# Altium schematic sheet Sheet_1_2023-03-25.schdoc
size 857 x 411 mm
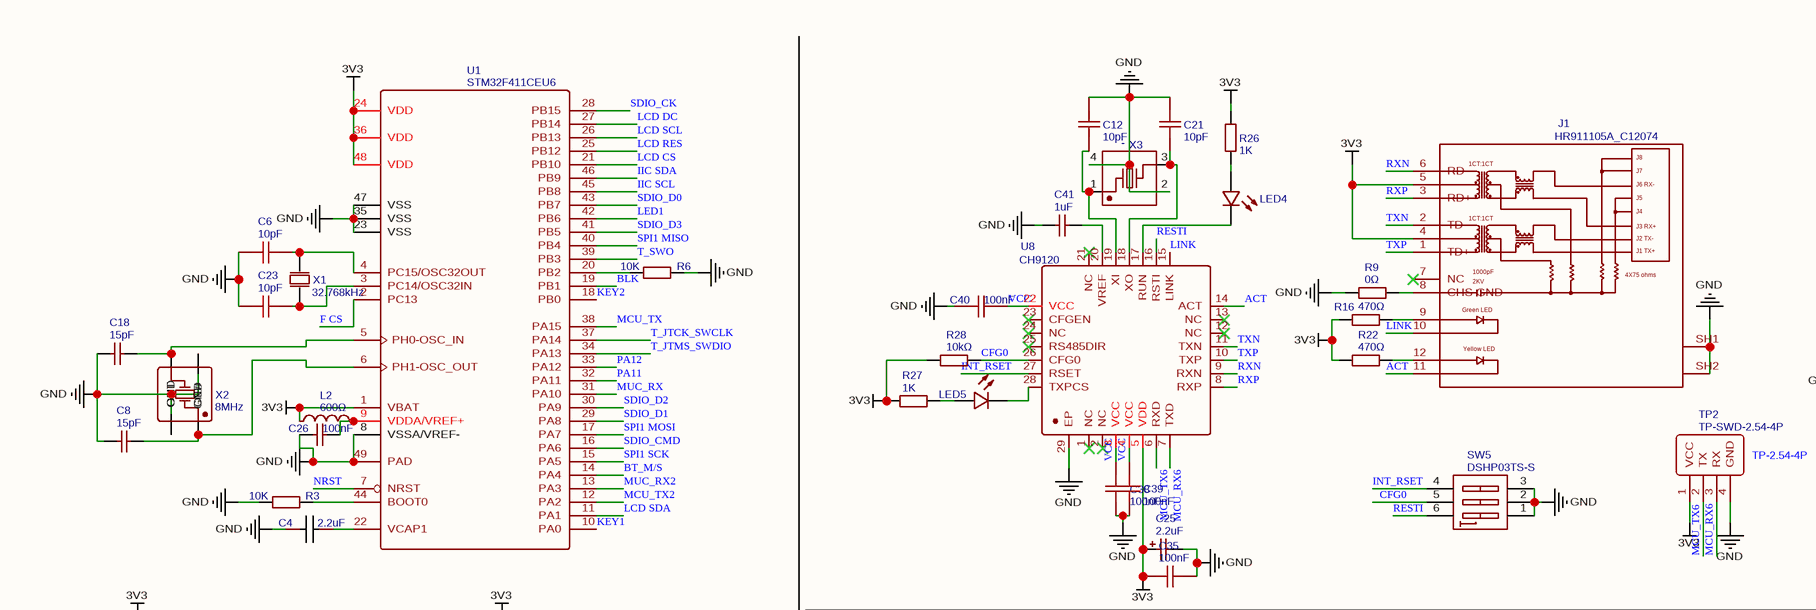
[diagram p0: Sheet_1_2023-03-25.schdoc, top left]
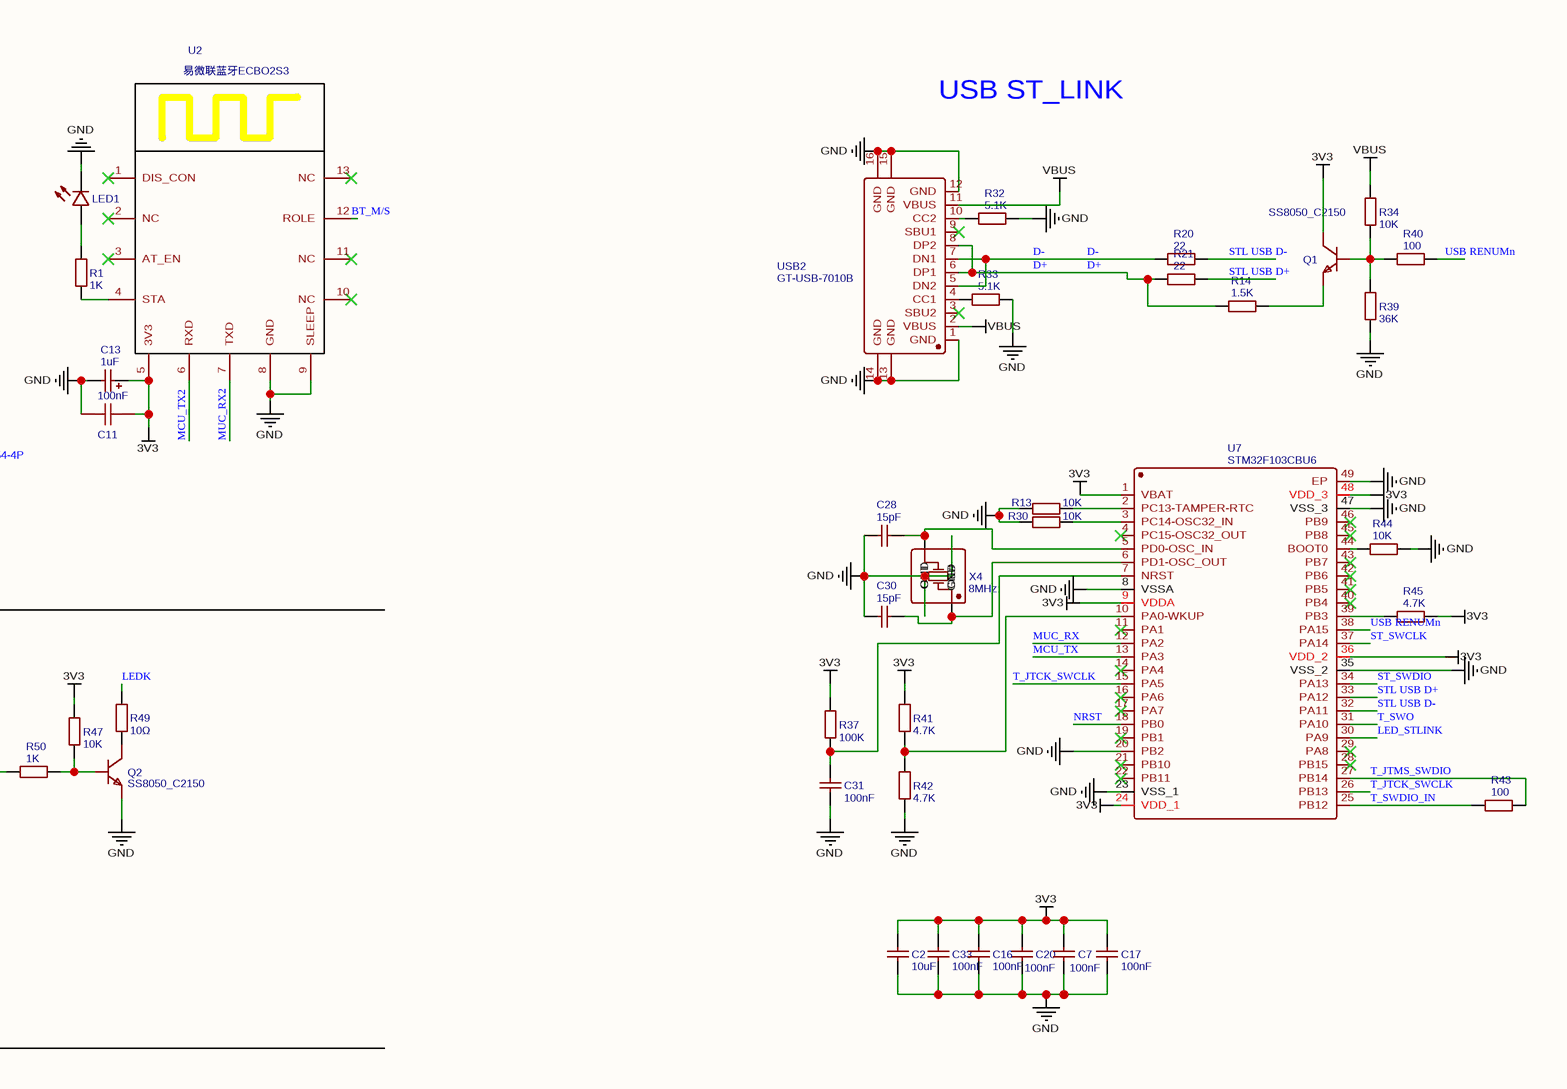
[diagram p1: Sheet_1_2023-03-25.schdoc, top middle]
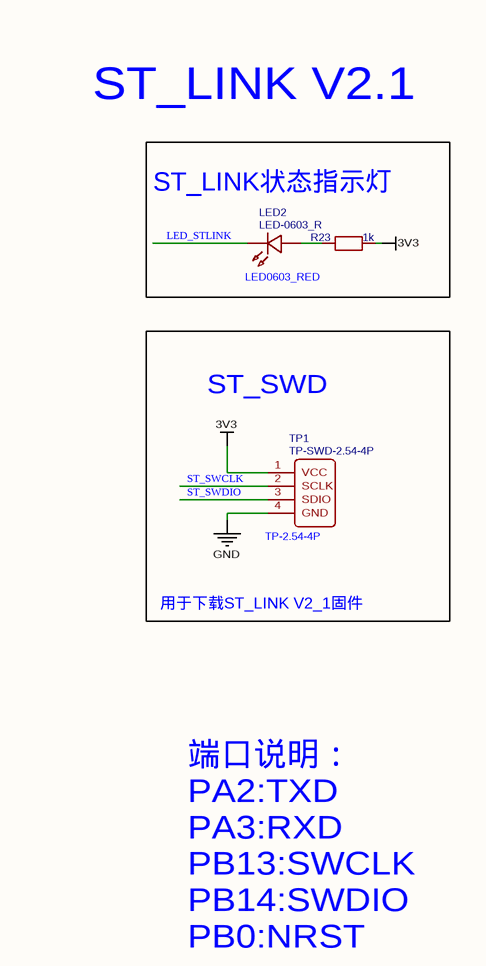
[diagram p2: Sheet_1_2023-03-25.schdoc, top right]
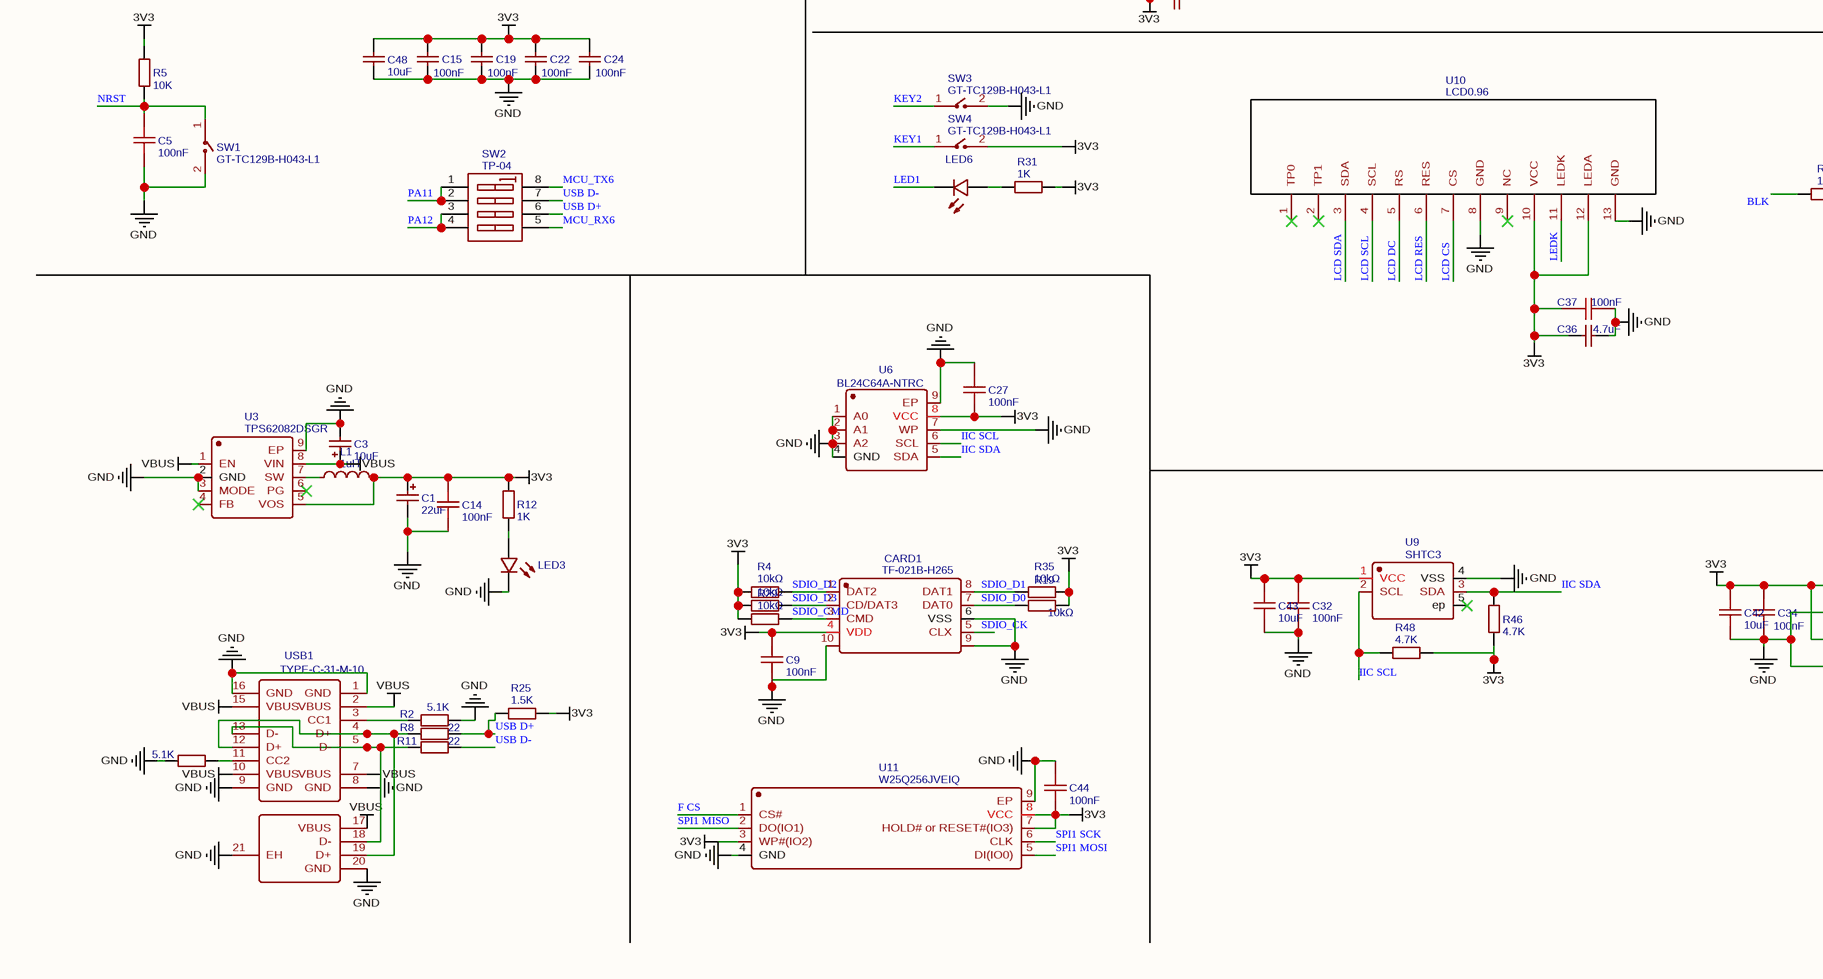
[diagram p3: Sheet_1_2023-03-25.schdoc, bottom left]
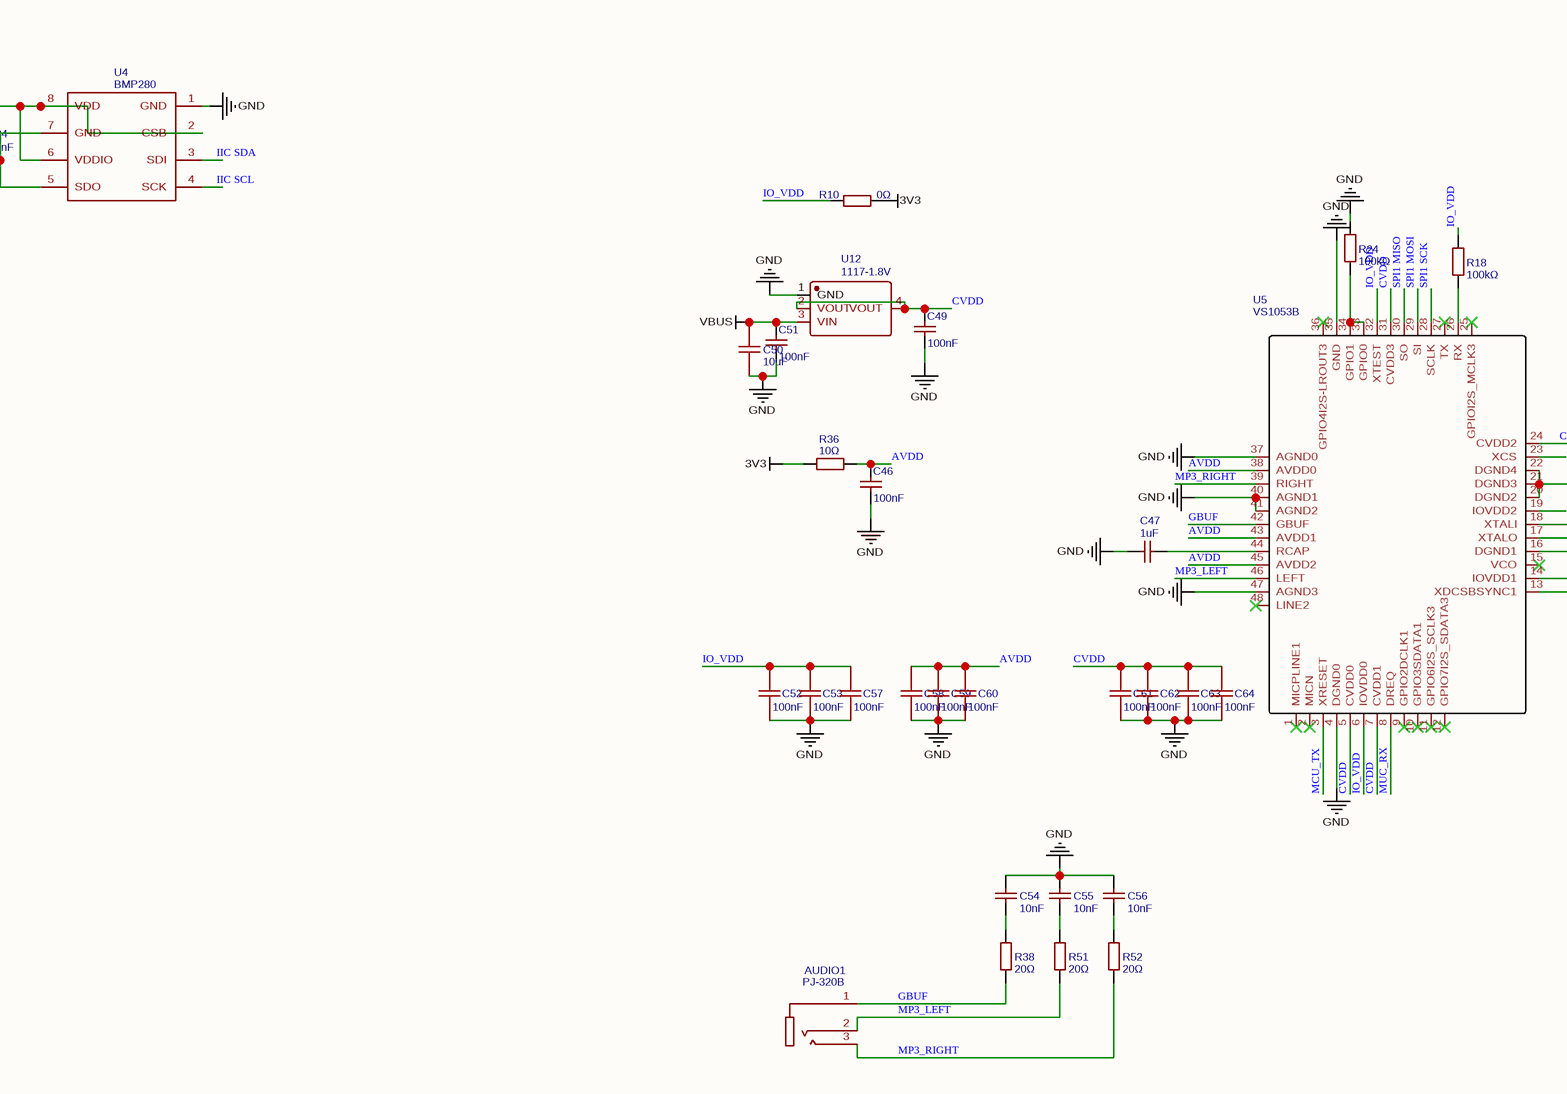
[diagram p4: Sheet_1_2023-03-25.schdoc, bottom middle]
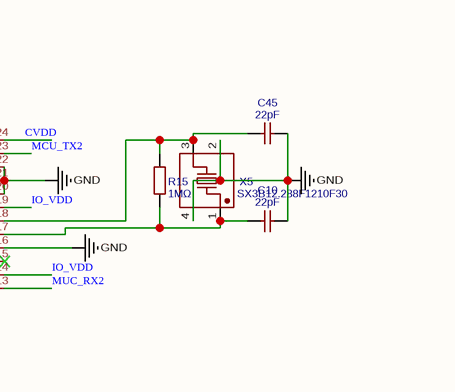
[diagram p5: Sheet_1_2023-03-25.schdoc, bottom right]

## Parts
AUDIO1  PJ-320B  [AUDIO-SMD_PJ-320B]
C1  22uF  [CAP-SMD_L3.2-W1.6-R-RD]
C2  10uF  [C0402]
C3  10uF  [CAP-SMD_L3.2-W1.6-R-RD]
C4  2.2uF  [C0402]
C5  100nF  [C0603]
C6  10pF  [C0402]
C7  100nF  [C0402_NEW]
C8  15pF  [C0402]
C9  100nF  [C0603]
C10  22pF  [C0603]
C11  100nF  [C0603]
C12  10pF  [C0402]
C13  1uF  [CAP-SMD_L3.2-W1.6-R-RD]
C14  100nF  [C0603]
C15  100nF  [C0402_NEW]
C16  100nF  [C0402_NEW]
C17  100nF  [C0402_NEW]
C18  15pF  [C0402]
C19  100nF  [C0402_NEW]
C20  100nF  [C0402_NEW]
C21  10pF  [C0402]
C22  100nF  [C0402_NEW]
C23  10pF  [C0402]
C24  100nF  [C0402_NEW]
C25  2.2uF  [CAP-SMD_L3.2-W1.6-RD]
C26  100nF  [C0402_NEW]
C27  100nF  [C0603]
C28  15pF  [C0402]
C30  15pF  [C0402]
C31  100nF  [C0402_NEW]
C32  100nF  [C0603]
C33  100nF  [C0402_NEW]
C34  100nF  [C0603]
C35  100nF  [C0603]
C36  4.7uF  [C0603]
C37  100nF  [C0603]
C38  100nF  [C0603]
C39  100nF  [C0603]
C40  100nF  [C0603]
C41  1uF  [C0603]
C42  10uF  [C0603]
C43  10uF  [C0603]
C44  100nF  [C0603]
C45  22pF  [C0603]
C46  100nF  [C0603]
C47  1uF  [C0603]
C48  10uF  [C0402]
C49  100nF  [C0603]
C50  10uF  [C0603]
C51  100nF  [C0603]
C52  100nF  [C0603]
C53  100nF  [C0603]
C54  10nF  [C0603]
C55  10nF  [C0603]
C56  10nF  [C0603]
C57  100nF  [C0603]
C58  100nF  [C0603]
C59  100nF  [C0603]
C60  100nF  [C0603]
C61  100nF  [C0603]
C62  100nF  [C0603]
C63  100nF  [C0603]
C64  100nF  [C0603]
CARD1  TF-021B-H265  [TF-SMD_TF-021B-H265]
J1  HR911105A_C12074  [RJ45-TH_HR911105A]
L1  1uH  [IND-SMD_L3.0-W3.0]
L2  600Ω  [L0402]
LED1  19-213/Y2C-CQ2R2L/3T(CY)  [LED0603-R-RD]  (value not drawn)
LED2  LED-0603_R  [LED0603_RED]
LED3  19-213/Y2C-CQ2R2L/3T(CY)  [LED0603-R-RD]  (value not drawn)
LED4  19-213/Y2C-CQ2R2L/3T(CY)  [LED0603-R-RD]  (value not drawn)
LED5  19-213/Y2C-CQ2R2L/3T(CY)  [LED0603-R-RD]  (value not drawn)
LED6  19-213/Y2C-CQ2R2L/3T(CY)  [LED0603-R-RD]  (value not drawn)
Q1  SS8050_C2150  [SOT-23-3_L2.9-W1.3-P1.90-LS2.4-BR]
Q2  SS8050_C2150  [SOT-23-3_L2.9-W1.3-P1.90-LS2.4-BR]
R1  1K  [R0603]
R2  5.1K  [R0603]
R3  10K  [R0402]
R4  10kΩ  [R0603]
R5  10K  [R0603]
R6  10K  [R0402]
R7  5.1K  [R0603]
R8  22  [R0603]
R9  0Ω  [R0603]
R10  0Ω  [R0603]
R11  22  [R0603]
R12  1K  [R0603]
R13  10K  [R0402]
R14  1.5K  [R0603]
R15  1MΩ  [R0603]
R16  470Ω  [R0603]
R17  10kΩ  [R0603]
R18  100kΩ  [R0603]
R19  10kΩ  [R0603]
R20  22  [R0603]
R21  22  [R0603]
R22  470Ω  [R0603]
R23  1k  [0603]
R24  100kΩ  [R0603]
R25  1.5K  [R0603]
R26  1K  [R0603]
R27  1K  [R0603]
R28  10kΩ  [R0603]
R29  10kΩ  [R0603]
R30  10K  [R0402]
R31  1K  [R0603]
R32  5.1K  [R0603]
R33  5.1K  [R0603]
R34  10K  [R0603]
R35  10kΩ  [R0603]
R36  10Ω  [R0603]
R37  100K  [R0402]
R38  20Ω  [R0603]
R39  36K  [R0603]
R40  100  [R0603]
R41  4.7K  [R0402]
R42  4.7K  [R0402]
R43  100  [R0402]
R44  10K  [R0402]
R45  4.7K  [R0402]
R46  4.7K  [R0603]
R47  10K  [R0603]
R48  4.7K  [R0603]
R49  10Ω  [R0603]
R50  1K  [R0603]
R51  20Ω  [R0603]
R52  20Ω  [R0603]
SW1  GT-TC129B-H043-L1  [SW-SMD_L6.0-W6.0-P6.00-LS8.0]
SW2  TP-04  [SW-SMD_8P-L6.7-W5.4-P1.27-LS8.5]
SW3  GT-TC129B-H043-L1  [SW-SMD_L6.0-W6.0-P6.00-LS8.0]
SW4  GT-TC129B-H043-L1  [SW-SMD_L6.0-W6.0-P6.00-LS8.0]
SW5  DSHP03TS-S  [SW-SMD_DSHP03TS-S]
TP1  TP-SWD-2.54-4P  [TP-2.54-4P]
TP2  TP-SWD-2.54-4P  [TP-2.54-4P]
U1  STM32F411CEU6  [UFQFPN-48_L7.0-W7.0-P0.50-BL-EP]
U2  易微联蓝牙ECBO2S3  [易微联蓝牙ECB02S3]
U3  TPS62082DSGR  [WSON-8_L2.0-W2.0-P0.50-TL-EP]
U4  BMP280  [SENSOR-TH_BMP280-BL]
U5  VS1053B  [LQFP-48_L7.0-W7.0-P0.50-LS9.0-BL]
U6  BL24C64A-NTRC  [UDFN-8L_L2.0-W3.0-P0.50-BL-EP]
U7  STM32F103CBU6  [UFQFPN-48_L7.0-W7.0-P0.50-BL-EP]
U8  CH9120  [QFN-28_L4.0-W4.0-P0.40-TL-EP2.4]
U9  SHTC3  [SENSORM-SMD_4P-L2.0-W2.0-P1.00]
U10  LCD0.96  [LCD0.96]
U11  W25Q256JVEIQ  [WSON-8_L6.0-W8.0-P1.27-BL-EP]
U12  1117-1.8V  [SOT-223-3_L6.5-W3.4-P2.30-LS7.0-BR]
USB1  TYPE-C-31-M-10  [USBC-TH_TYPE-C-31-M-10]
USB2  GT-USB-7010B  [USB-C-SMD_GT-USB-7010B]
X1  32.768kHz  [FC-12M_L2.0-W1.2]
X2  8MHz  [OSC-SMD_4P-L3.2-W2.5-BL]
X3  -  [OSC-SMD_4P-L2.0-W1.6-BL]
X4  8MHz  [OSC-SMD_4P-L3.2-W2.5-BL]
X5  SX3B12.288F1210F30  [CRYSTAL-SMD_4P-L3.2-W2.5-BL]

## Blocks framed on the sheet
ST_LINK状态指示灯: LED2 R23
ST_SWD: TP1

## Nets
3V3: C1.1 C2.2 C7.2 C9.2 C11.1 C13.1 C14.2 C15.2 C16.2 C17.2 C19.2 C20.2 C22.2 C24.2 C25.1 C27.1 C32.2 C33.2 C34.2 C35.1 C36.1 C37.2 C42.2 C43.2 C44.2 C48.2 CARD1.4(VDD) J1.4 J1.5 L1.2 L2.1 Q1.3(C) R4.1 R5.1 R10.2 R12.2 R16.1 R17.1 R19.2 R22.1 R23.1 R25.2 R26.2 R27.2 R28.1 R29.1 R31.2 R35.2 R36.2 R37.2 R41.1 R45.1 R46.1 R47.2 R48.1 SW4.2 TP1.1(VCC) TP2.1(VCC) U1.1(VBAT) U1.24(VDD) U1.36(VDD) U1.48(VDD) U2.5(3V3) U3.5(VOS) U4.2(CSB) U4.6(VDDIO) U4.8(VDD) U6.8(VCC) U7.1(VBAT) U7.9(VDDA) U7.24(VDD_1) U7.36(VDD_2) U7.48(VDD_3) U8.5(VDD) U9.1(VCC) U10.10(VCC) U10.12(LEDA) U11.3(WP#(IO2)) U11.7(HOLD#_or_RESET#(IO3)) U11.8(VCC)
GND: C1.2 C2.1 C3.2 C4.1 C5.1 C6.2 C7.1 C8.1 C9.1 C10.1 C11.2 C12.1 C13.2 C14.1 C15.1 C16.1 C17.1 C18.1 C19.1 C20.1 C21.1 C22.1 C23.2 C24.1 C25.2 C26.2 C27.2 C28.1 C30.1 C31.1 C32.1 C33.1 C34.1 C35.2 C36.2 C37.1 C38.2 C39.2 C40.2 C41.1 C42.1 C43.1 C44.1 C45.1 C46.1 C47.1 C48.1 C49.1 C50.1 C51.1 C52.1 C53.1 C54.2 C55.2 C56.2 C57.1 C58.1 C59.1 C60.1 C61.1 C62.1 C63.1 C64.1 CARD1.6(VSS) CARD1.9 CARD1.10 J1.SH1 J1.SH2 LED1.2(C) LED3.2(C) Q2.2(E) R2.2 R3.1 R6.2 R7.1 R9.1 R13.2 R24.2 R30.2 R32.2 R33.2 R39.1 R42.2 R44.1 SW1.2 SW3.2 SW5.1 SW5.2 SW5.3 TP1.4(GND) TP2.4(GND) U1.8(VSSA/VREF-) U1.23(VSS) U1.35(VSS) U1.47(VSS) U1.49(PAD) U2.8(GND) U2.9(SLEEP) U3.2(GND) U3.3(MODE) U3.9(EP) U4.1(GND) U4.5(SDO) U4.7(GND) U5.4(DGND0) U5.16(DGND1) U5.20(DGND2) U5.21(DGND3) U5.22(DGND4) U5.35(GND) U5.37(AGND0) U5.40(AGND1) U5.41(AGND2) U5.47(AGND3) U6.1(A0) U6.2(A1) U6.3(A2) U6.4(GND) U6.7(WP) U6.9(EP) U7.8(VSSA) U7.20(PB2) U7.23(VSS_1) U7.35(VSS_2) U7.47(VSS_3) U7.49(EP) U8.29(EP) U9.4(VSS) U10.8(GND) U10.13(GND) U11.4(GND) U11.9(EP) U12.1(GND) USB1.1(GND) USB1.8(GND) USB1.9(GND) USB1.16(GND) USB1.20(GND) USB1.21(EH) USB2.1(GND) USB2.12(GND) USB2.13(GND) USB2.14(GND) USB2.15(GND) USB2.16(GND) X2.2(GND) X2.4(GND) X3.2(GND) X3.4(GND) X4.2(GND) X4.4(GND) X5.2(GND) X5.4(GND)
VBUS: C3.1 C50.2 C51.2 R34.2 U3.1(EN) U3.8(VIN) U12.3(VIN) USB1.2(VBUS) USB1.7(VBUS) USB1.10(VBUS) USB1.15(VBUS) USB1.17(VBUS) USB2.2(VBUS) USB2.11(VBUS)
ACT: J1.11 U8.14(ACT)
AVDD: C46.2 C58.2 C59.2 C60.2 R36.1 U5.38(AVDD0) U5.43(AVDD1) U5.45(AVDD2)
BLK: R50.1 U1.19(PB1)
BT_M/S: U1.14(PA4) U2.12(ROLE)
CFG0: R28.2 SW5.5 U8.26(CFG0)
CVDD: C49.2 C61.2 C62.2 C63.2 C64.2 U5.5(CVDD0) U5.7(CVDD1) U5.24(CVDD2) U5.31(CVDD3) U12.2(VOUT) U12.4(VOUT)
D+: R14.2 R21.1 USB2.6(DP1) USB2.8(DP2)
D-: R20.1 USB2.5(DN2) USB2.7(DN1)
F CS: U1.2(PC13) U11.1(CS#)
GBUF: AUDIO1.1 R38.1 U5.42(GBUF)
IIC SCL: R48.2 U1.45(PB8) U4.4(SCK) U6.6(SCL) U9.2(SCL)
IIC SDA: R46.2 U1.46(PB9) U4.3(SDI) U6.5(SDA) U9.3(SDA)
INT_RSET: SW5.4 U8.27(RSET)
IO_VDD: C52.2 C53.2 C57.2 R10.1 R18.2 U5.6(IOVDD0) U5.14(IOVDD1) U5.19(IOVDD2) U5.32(XTEST)
KEY1: SW4.1 U1.10(PA0)
KEY2: SW3.1 U1.18(PB0)
LCD CS: U1.21(PB10) U10.7(CS)
LCD DC: U1.27(PB14) U10.5(RS)
LCD RES: U1.25(PB12) U10.6(RES)
LCD SCL: U1.26(PB13) U10.4(SCL)
LCD SDA: U1.11(PA1) U10.3(SDA)
LED1: LED6.2(C) U1.42(PB6)
LED_STLINK: LED2.2 U7.30(PA9)
LEDK: R49.2 U10.11(LEDK)
LINK: J1.10 U8.15(LINK)
MCU_RX6: SW2.5(B4) TP2.3(RX) U8.7(TXD)
MCU_TX: U1.38(PA15) U5.3(XRESET) U7.13(PA3)
MCU_TX2: U1.12(PA2) U2.6(RXD) U5.23(XCS)
MCU_TX6: SW2.8(B1) TP2.2(TX) U8.6(RXD)
MP3_LEFT: AUDIO1.2 R51.1 U5.46(LEFT)
MP3_RIGHT: AUDIO1.3 R52.1 U5.39(RIGHT)
MUC_RX: U1.31(PA10) U5.8(DREQ) U7.12(PA2)
MUC_RX2: U1.13(PA3) U2.7(TXD) U5.13(XDCSBSYNC1)
NRST: C5.2 R5.2 SW1.1 U1.7(NRST) U7.18(PB0)
PA11: SW2.1(A1) SW2.2(A2) U1.32(PA11)
PA12: SW2.3(A3) SW2.4(A4) U1.33(PA12)
RESTI: SW5.6 U8.16(RSTI)
RXN: J1.6(RD-) U8.9(RXN)
RXP: J1.3(RD+) U8.8(RXP)
SDIO_CK: CARD1.5(CLX) U1.28(PB15)
SDIO_CMD: CARD1.3(CMD) R29.2 U1.16(PA6)
SDIO_D0: CARD1.7(DAT0) R19.1 U1.43(PB7)
SDIO_D1: CARD1.8(DAT1) R35.1 U1.29(PA8)
SDIO_D2: CARD1.1(DAT2) R4.2 U1.30(PA9)
SDIO_D3: CARD1.2(CD/DAT3) R17.2 U1.41(PB5)
SPI1 MISO: U1.40(PB4) U5.30(SO) U11.2(DO(IO1))
SPI1 MOSI: U1.17(PA7) U5.29(SI) U11.5(DI(IO0))
SPI1 SCK: U1.15(PA5) U5.28(SCLK) U11.6(CLK)
ST_SWCLK: TP1.2(SCLK) U7.37(PA14)
ST_SWDIO: TP1.3(SDIO) U7.34(PA13)
STL USB D+: R21.2 U7.33(PA12)
STL USB D-: R20.2 U7.32(PA11)
T_JTCK_SWCLK: U1.37(PA14) U7.15(PA5) U7.26(PB13)
T_JTMS_SWDIO: R43.2 U1.34(PA13) U7.27(PB14)
T_SWDIO_IN: R43.1 U7.25(PB12)
T_SWO: U1.39(PB3) U7.31(PA10)
TXN: J1.2(TD-) U8.11(TXN)
TXP: J1.1(TD+) U8.10(TXP)
USB D+: R8.2 R25.1 SW2.6(B3)
USB D-: R11.2 SW2.7(B2)
USB RENUMn: R40.2 U7.38(PA15)
VCC: C38.1 C39.1 C40.1 U8.3(VCC) U8.4(VCC) U8.22(VCC)
NetC4_2: C4.2 U1.22(VCAP1)
NetC6_1: C6.1 U1.4(PC15/OSC32OUT) X1.2(OSC2)
NetC8_2: C8.2 U1.6(PH1-OSC_OUT) X2.1(OE#)
NetC10_2: C10.2 R15.2 U5.17(XTALO) X5.1
NetC12_2: C12.2 U8.19(XI) X3.1
NetC18_2: C18.2 U1.5(PH0-OSC_IN) X2.3(OUT)
NetC21_2: C21.2 U8.18(XO) X3.3
NetC23_1: C23.1 U1.3(PC14/OSC32IN) X1.1(OSC1)
NetC26_1: C26.1 L2.2 U1.9(VDDA/VREF+)
NetC28_2: C28.2 U7.5(PD0-OSC_IN) X4.3(OUT)
NetC30_2: C30.2 U7.6(PD1-OSC_OUT) X4.1(OE#)
NetC31_2: C31.2 R37.1 U7.7(NRST)
NetC41_2: C41.2 U8.20(VREF)
NetC45_2: C45.2 R15.1 U5.18(XTALI) X5.3
NetC47_2: C47.2 U5.44(RCAP)
NetC54_1: C54.1 R38.2
NetC55_1: C55.1 R51.2
NetC56_1: C56.1 R52.2
NetJ1_8: J1.8(CHS_GND) R9.2
NetJ1_9: J1.9 R16.2
NetJ1_12: J1.12 R22.2
NetL1_1: L1.1 U3.7(SW)
NetLED1_1: LED1.1(A) R1.1
NetLED2_1: LED2.1 R23.2
NetLED3_1: LED3.1(A) R12.1
NetLED4_1: LED4.1(A) R26.1
NetLED4_2: LED4.2(C) U8.17(RUN)
NetLED5_1: LED5.1(A) R27.1
NetLED5_2: LED5.2(C) U8.28(TXPCS)
NetLED6_1: LED6.1(A) R31.1
NetQ1_1: Q1.1(B) R34.1 R39.2 R40.1
NetQ1_2: Q1.2(E) R14.1
NetQ2_1: Q2.1(B) R47.1 R50.2
NetQ2_3: Q2.3(C) R49.1
NetR1_2: R1.2 U2.4(STA)
NetR2_1: R2.1 USB1.3(CC1)
NetR3_2: R3.2 U1.44(BOOT0)
NetR6_1: R6.1 U1.20(PB2)
NetR7_2: R7.2 USB1.11(CC2)
NetR8_1: R8.1 USB1.4(D+) USB1.12(D+) USB1.19(D+)
NetR11_1: R11.1 USB1.5(D-) USB1.13(D-) USB1.18(D-)
NetR13_1: R13.1 U7.2(PC13-TAMPER-RTC)
NetR18_1: R18.1 U5.26(RX)
NetR24_1: R24.1 U5.33(GPIO0) U5.34(GPIO1)
NetR30_1: R30.1 U7.3(PC14-OSC32_IN)
NetR32_1: R32.1 USB2.10(CC2)
NetR33_1: R33.1 USB2.4(CC1)
NetR41_2: R41.2 R42.1 U7.10(PA0-WKUP)
NetR44_2: R44.2 U7.44(BOOT0)
NetR45_2: R45.2 U7.39(PB3)

Not connected (* = marked no-connect by the designer): J1 7(NC)*; U2 1(DIS_CON)* 2(NC)* 3(AT_EN)* 10(NC)* 11(NC)* 13(NC)*; U3 4(FB)* 6(PG)*; U5 1(MICPLINE1)* 2(MICN)* 9(GPIO2DCLK1)* 10(GPIO3SDATA1)* 11(GPIO6I2S_SCLK3)* 12(GPIO7I2S_SDATA3)* 15(VCO)* 25(GPIOI2S_MCLK3)* 27(TX)* 36(GPIO4I2S-LROUT3)* 48(LINE2)*; U7 4(PC15-OSC32_OUT)* 11(PA1)* 14(PA4)* 16(PA6)* 17(PA7)* 19(PB1)* 21(PB10)* 22(PB11)* 28(PB15)* 29(PA8)* 40(PB4)* 41(PB5)* 42(PB6)* 43(PB7)* 45(PB8)* 46(PB9)*; U8 1(NC)* 2(NC)* 12(NC)* 13(NC)* 21(NC)* 23(CFGEN)* 24(NC)* 25(RS485DIR)*; U9 5(ep)*; U10 1(TP0)* 2(TP1)* 9(NC)*; USB2 3(SBU2)* 9(SBU1)*

## Notes on the sheet
- USB ST_LINK
- ST_LINK V2.1
- 用于下载ST_LINK V2_1固件
- 端口说明：
  PA2:TXD
  PA3:RXD
  PB13:SWCLK
  PB14:SWDIO
  PB0:NRST
- (in symbol HR911105A_C12074) J8; 1CT:1CT; J7; J6 RX-; J5; J4; J3 RX+; J2 TX-; J1 TX+; 1000pF; 4X75 ohms; 2KV; Green LED; Yellow LED
- (in symbol LED-0603_R) LED0603_RED
- (in symbol TP-SWD-2.54-4P) TP-2.54-4P

## Library data of the parts
AUDIO1 = PJ-320B: BOM_Manufacturer: BOOMELE; Contributor: LCSC; BOM_Supplier: LCSC; BOM_Manufacturer Part: PJ-320B; BOM_Supplier Part: C18594; BOM_JLCPCB Part Class: Extended Part; spicePre: A; spiceSymbolName: PJ-320B
C1 = 22uF: BOM_Manufacturer: Sunlord; BOM_Manufacturer Part: TC212A226M010A; nameAlias: Capacitance; BOM_Supplier: LCSC; BOM_Supplier Part: C97062; BOM_JLCPCB Part Class: Extended Part; spicePre: C; spiceSymbolName: TC212A226M010A
C2 C48 = 10uF: BOM_Manufacturer Part: CL05A106MQ5NUNC; BOM_Manufacturer: SAMSUNG; nameAlias: Capacitance; BOM_Supplier: LCSC; BOM_Supplier Part: C15525; BOM_JLCPCB Part Class: Basic Part; spicePre: C; spiceSymbolName: CL05A106MQ5NUNC
C3 = 10uF: BOM_Manufacturer: Sunlord; BOM_Manufacturer Part: TC212A106K016B; nameAlias: Capacitance; BOM_Supplier: LCSC; BOM_Supplier Part: C124854; BOM_JLCPCB Part Class: Extended Part; spicePre: C; spiceSymbolName: TC212A106K016B
C4 = 2.2uF: BOM_Manufacturer Part: CL05A225MQ5NSNC; BOM_Manufacturer: SAMSUNG; nameAlias: Capacitance; BOM_Supplier: LCSC; BOM_Supplier Part: C12530; BOM_JLCPCB Part Class: Basic Part; spicePre: C; spiceSymbolName: CL05A225MQ5NSNC
C5 C9 C11 C14 C27 C32 C34 C35 C37-C40 C44 C52 C53 C57-C64 = 100nF: BOM_Manufacturer: YAGEO; BOM_Manufacturer Part: CC0603KRX7R9BB104; nameAlias: Capacitance; BOM_Paste Type: base; BOM_Supplier: LCSC; BOM_Supplier Part: C14663; spicePre: C; spiceSymbolName: CC0603KRX7R9BB104
  C5 C9 C11 C14 C32 C34 C44: BOM_JLCPCB Part Class: Basic Part
C6 C12 C21 C23 = 10pF: BOM_Manufacturer: SAMSUNG; BOM_Manufacturer Part: CL05C100JB5NNNC; nameAlias: Capacitance; BOM_Supplier: LCSC; BOM_Supplier Part: C32949; BOM_JLCPCB Part Class: Basic Part; spicePre: C; spiceSymbolName: CL05C100JB5NNNC
C7 C15-C17 C19 C20 C22 C24 C26 C31 C33 = 100nF: BOM_Manufacturer Part: CL05B104KO5NNNC; BOM_Manufacturer: SAMSUNG; nameAlias: Capacitance; BOM_Supplier: LCSC; BOM_Supplier Part: C1525; BOM_JLCPCB Part Class: Basic Part; spicePre: C; spiceSymbolName: CL05B104KO5NNNC
C8 C18 C28 C30 = 15pF: BOM_Manufacturer: FH; BOM_Manufacturer Part: 0402CG150J500NT; nameAlias: Capacitance; BOM_Supplier: LCSC; BOM_Supplier Part: C1548; BOM_JLCPCB Part Class: Basic Part; spicePre: C; spiceSymbolName: 0402CG150J500NT
C10 C45 = 22pF: BOM_Manufacturer Part: CL10C220JB8NNNC; BOM_Manufacturer: SAMSUNG; nameAlias: Capacitance; BOM_Supplier: LCSC; BOM_Supplier Part: C1653; BOM_JLCPCB Part Class: Basic Part; spicePre: C; spiceSymbolName: CL10C220JB8NNNC
C13 = 1uF: BOM_Manufacturer: AVX; BOM_Manufacturer Part: TAJA105K016RNJ; nameAlias: Capacitance; BOM_Supplier: LCSC; BOM_Supplier Part: C7174; BOM_JLCPCB Part Class: Extended Part; spicePre: C; spiceSymbolName: TAJA105K016RNJ
C25 = 2.2uF: BOM_Manufacturer: AVX; BOM_Manufacturer Part: TAJA225K016RNJ; nameAlias: Capacitance; BOM_Supplier: LCSC; BOM_Supplier Part: C7180; BOM_JLCPCB Part Class: Extended Part; spicePre: C; spiceSymbolName: TAJA225K016RNJ
C36 = 4.7uF: BOM_Manufacturer Part: CL10A475KO8NNNC; BOM_Manufacturer: SAMSUNG; nameAlias: Capacitance; BOM_Supplier: LCSC; BOM_Supplier Part: C19666; BOM_JLCPCB Part Class: Basic Part; spicePre: C; spiceSymbolName: CL10A475KO8NNNC
C41 C47 = 1uF: BOM_Manufacturer Part: CL10A105KB8NNNC; BOM_Manufacturer: SAMSUNG; nameAlias: Capacitance; BOM_Supplier: LCSC; BOM_Supplier Part: C15849; BOM_JLCPCB Part Class: Basic Part; spicePre: C; spiceSymbolName: CL10A105KB8NNNC
C42 C43 C50 = 10uF: BOM_Manufacturer: SAMSUNG; BOM_Manufacturer Part: CL10A106KP8NNNC; nameAlias: Capacitance; BOM_Supplier: LCSC; BOM_Supplier Part: C19702; BOM_JLCPCB Part Class: Basic Part; spicePre: C; spiceSymbolName: CL10A106KP8NNNC
C46 C49 C51 = 100nF: BOM_Manufacturer: YAGEO; BOM_Manufacturer Part: CC0603KRX7R8BB104; nameAlias: Capacitance; BOM_Supplier: LCSC; BOM_Supplier Part: C92490; spicePre: C; spiceSymbolName: CC0603KRX7R8BB104
C54-C56 = 10nF: BOM_Manufacturer: FH; BOM_Manufacturer Part: 0603B103K500NT; nameAlias: Capacitance; BOM_Supplier: LCSC; BOM_Supplier Part: C57112; BOM_JLCPCB Part Class: Basic Part; spicePre: C; spiceSymbolName: 0603B103K500NT
CARD1 = TF-021B-H265: BOM_Manufacturer: SOFNG; Contributor: LCSC; BOM_Supplier: LCSC; BOM_Supplier Part: C498185; BOM_Manufacturer Part: TF-021B-H265; BOM_JLCPCB Part Class: Extended Part; spicePre: C; spiceSymbolName: TF-021B-H265
J1 = HR911105A_C12074: BOM_Manufacturer: HANRUN; BOM_Supplier: LCSC; BOM_Manufacturer Part: HR911105A; BOM_Supplier Part: C12074; BOM_JLCPCB Part Class: Extended Part; spicePre: J; spiceSymbolName: HR911105A_C12074
L1 = 1uH: BOM_Manufacturer: Sunlord; BOM_Manufacturer Part: SPH3012H1R0MT; nameAlias: Inductance; Contributor: LCSC; BOM_Supplier: LCSC; BOM_Supplier Part: C98388; BOM_JLCPCB Part Class: Extended Part; spicePre: L; spiceSymbolName: SPH3012H1R0MT
L2 = 600Ω: BOM_Manufacturer: TDK; BOM_Manufacturer Part: MMZ1005Y601CT000; nameAlias: Value; BOM_Supplier: LCSC; BOM_Supplier Part: C87552; BOM_JLCPCB Part Class: Extended Part; spicePre: L; spiceSymbolName: MMZ1005Y601CT000
LED1 LED3-LED6 = 19-213/Y2C-CQ2R2L/3T(CY): BOM_Manufacturer: EVERLIGHT; BOM_Supplier: LCSC; BOM_Manufacturer Part: 19-213/Y2C-CQ2R2L/3T(CY); BOM_Supplier Part: C72038; BOM_JLCPCB Part Class: Basic Part; spicePre: L; spiceSymbolName: 19-213/Y2C-CQ2R2L/3T(CY)
LED2 = LED-0603_R: BOM_Manufacturer: EVERLIGHT(台湾亿光); BOM_Manufacturer Part: 19-217/R6C-AL1M2VY/3T; Contributor: LCEDA_01; Package Display: Yes; BOM_Supplier Part: C72044; BOM_Supplier: LCSC; spicePre: L; spiceSymbolName: LED-0603_R
Q1 Q2 = SS8050_C2150: BOM_Manufacturer: CJ; BOM_Manufacturer Part: SS8050; BOM_Supplier: LCSC; BOM_Supplier Part: C2150; BOM_JLCPCB Part Class: Basic Part; spicePre: Q; spiceSymbolName: SS8050_C2150
R1 R12 R26 R27 R31 R50 = 1K: BOM_Manufacturer: UniOhm; BOM_Manufacturer Part: 0603WAF1001T5E; nameAlias: Resistance (Ohms); BOM_Supplier: LCSC; BOM_Supplier Part: C21190; BOM_JLCPCB Part Class: Basic Part; spicePre: R; spiceSymbolName: 0603WAF1001T5E
R2 R7 R32 R33 = 5.1K: BOM_Manufacturer Part: 0603WAF5101T5E; BOM_Manufacturer: UniOhm; nameAlias: Resistance (Ohms); BOM_Supplier: LCSC; BOM_Supplier Part: C23186; BOM_JLCPCB Part Class: Basic Part; spicePre: R; spiceSymbolName: 0603WAF5101T5E
R3 R6 R13 R30 R44 = 10K: BOM_Manufacturer: UniOhm; BOM_Manufacturer Part: 0402WGF1002TCE; nameAlias: Resistance (Ohms); BOM_Supplier: LCSC; BOM_Supplier Part: C25744; BOM_JLCPCB Part Class: Basic Part; spicePre: R; spiceSymbolName: 0402WGF1002TCE
R4 R17 R19 R28 R29 R35 = 10kΩ: BOM_Manufacturer: UniOhm; BOM_Manufacturer Part: 0603WAF1002T5E; nameAlias: Resistance; Resistance (Ohms): 10K; BOM_Supplier: LCSC; BOM_Supplier Part: C25804; BOM_JLCPCB Part Class: Basic Part; spicePre: R; spiceSymbolName: 0603WAF1002T5E
R5 R34 = 10K: BOM_Manufacturer: Viking Tech; BOM_Manufacturer Part: AR03DTCX1002; nameAlias: Resistance (Ohms); Contributor: LCSC; BOM_Supplier: LCSC; BOM_Supplier Part: C319937; spicePre: R; spiceSymbolName: AR03DTCX1002
R8 R11 R20 R21 = 22: BOM_Manufacturer: UniOhm; BOM_Manufacturer Part: 0603WAF220JT5E; nameAlias: Resistance (Ohms); BOM_Supplier: LCSC; BOM_Supplier Part: C23345; BOM_JLCPCB Part Class: Basic Part; spicePre: R; spiceSymbolName: 0603WAF220JT5E
R9 R10 = 0Ω: BOM_Manufacturer: UniOhm; BOM_Manufacturer Part: 0603WAF0000T5E; nameAlias: Resistance; Resistance (Ohms): 0; BOM_Supplier: LCSC; BOM_Supplier Part: C21189; BOM_JLCPCB Part Class: Basic Part; spicePre: R; spiceSymbolName: 0603WAF0000T5E
R14 R25 = 1.5K: BOM_Manufacturer: UniOhm; BOM_Manufacturer Part: 0603WAF1501T5E; nameAlias: Resistance (Ohms); BOM_Supplier: LCSC; BOM_Supplier Part: C22843; BOM_JLCPCB Part Class: Basic Part; spicePre: R; spiceSymbolName: 0603WAF1501T5E
R15 = 1MΩ: BOM_Manufacturer: UniOhm; BOM_Manufacturer Part: 0603WAF1004T5E; nameAlias: Resistance; Resistance (Ohms): 1M; BOM_Supplier: LCSC; BOM_Supplier Part: C22935; BOM_JLCPCB Part Class: Basic Part; spicePre: R; spiceSymbolName: 0603WAF1004T5E
R16 R22 = 470Ω: BOM_Manufacturer: UniOhm; BOM_Manufacturer Part: 0603WAF4700T5E; nameAlias: Resistance; Resistance (Ohms): 470; BOM_Supplier: LCSC; BOM_Supplier Part: C23179; BOM_JLCPCB Part Class: Basic Part; spicePre: R; spiceSymbolName: 0603WAF4700T5E
R18 R24 = 100kΩ: BOM_Manufacturer: UniOhm; BOM_Manufacturer Part: 0603WAF1003T5E; nameAlias: Resistance; Resistance (Ohms): 100K; BOM_Supplier: LCSC; BOM_Supplier Part: C25803; BOM_JLCPCB Part Class: Basic Part; spicePre: R; spiceSymbolName: 0603WAF1003T5E
R23 = 1k: BOM_Manufacturer: YAGEO; nameAlias: Value(Ω); spicePre: R; spiceSymbolName: Res_0603(1/10W)_EU; BOM_Supplier: LCSC; BOM_Supplier Part: C22548
R36 R49 = 10Ω: BOM_Manufacturer: UniOhm; BOM_Manufacturer Part: 0603WAF100JT5E; nameAlias: Resistance (Ohms); BOM_Supplier: LCSC; BOM_Supplier Part: C22859; BOM_JLCPCB Part Class: Basic Part; spicePre: R; spiceSymbolName: 0603WAF100JT5E
R37 = 100K: BOM_Manufacturer: UniOhm; BOM_Manufacturer Part: 0402WGF1003TCE; nameAlias: Resistance (Ohms); BOM_Supplier: LCSC; BOM_Supplier Part: C25741; BOM_JLCPCB Part Class: Basic Part; spicePre: R; spiceSymbolName: 0402WGF1003TCE
R38 R51 R52 = 20Ω: BOM_Manufacturer: UniOhm; BOM_Manufacturer Part: 0603WAF200JT5E; nameAlias: Resistance; Resistance (Ohms): 20; BOM_Supplier: LCSC; BOM_Supplier Part: C22950; BOM_JLCPCB Part Class: Basic Part; spicePre: R; spiceSymbolName: 0603WAF200JT5E
R39 = 36K: BOM_Manufacturer: UniOhm; BOM_Manufacturer Part: 0603WAF3602T5E; nameAlias: Resistance (Ohms); BOM_Supplier: LCSC; BOM_Supplier Part: C23147; BOM_JLCPCB Part Class: Basic Part; spicePre: R; spiceSymbolName: 0603WAF3602T5E
R40 = 100: BOM_Manufacturer: UniOhm; BOM_Manufacturer Part: 0603WAF1000T5E; nameAlias: Resistance (Ohms); BOM_Supplier: LCSC; BOM_Supplier Part: C22775; BOM_JLCPCB Part Class: Basic Part; spicePre: R; spiceSymbolName: 0603WAF1000T5E
R41 R42 R45 = 4.7K: BOM_Manufacturer: UniOhm; BOM_Manufacturer Part: 0402WGF4701TCE; nameAlias: Resistance (Ohms); BOM_Supplier: LCSC; BOM_Supplier Part: C25900; BOM_JLCPCB Part Class: Basic Part; spicePre: R; spiceSymbolName: 0402WGF4701TCE
R43 = 100: BOM_Manufacturer: UniOhm; BOM_Manufacturer Part: 0402WGF1000TCE; nameAlias: Resistance (Ohms); BOM_Supplier: LCSC; BOM_Supplier Part: C25076; BOM_JLCPCB Part Class: Basic Part; spicePre: R; spiceSymbolName: 0402WGF1000TCE
R46 R48 = 4.7K: BOM_Manufacturer: UniOhm; BOM_Manufacturer Part: 0603WAJ0472T5E; nameAlias: Resistance (Ohms); BOM_Paste Type: expand; BOM_Assembly Type: smtWeld; BOM_Supplier: LCSC; BOM_Supplier Part: C25999; spicePre: R; spiceSymbolName: 0603WAJ0472T5E
R47 = 10K: BOM_Manufacturer: UniOhm; BOM_Manufacturer Part: 0603WAF1002T5E; nameAlias: Resistance (Ohms); BOM_Paste Type: base; BOM_Supplier: LCSC; BOM_Supplier Part: C25804; spicePre: R; spiceSymbolName: 0603WAF1002T5E
SW1 SW3 SW4 = GT-TC129B-H043-L1: BOM_Manufacturer: G-Switch(品赞); Contributor: LCSC; BOM_Supplier: LCSC; BOM_Supplier Part: C2930980; BOM_Manufacturer Part: GT-TC129B-H043-L1; spicePre: S; spiceSymbolName: GT-TC129B-H043-L1
SW2 = TP-04: BOM_Manufacturer: Yuandi; Contributor: LCSC; BOM_Supplier: LCSC; BOM_Supplier Part: C559167; BOM_Manufacturer Part: TP-04; BOM_JLCPCB Part Class: Extended Part; spicePre: S; spiceSymbolName: TP-04
SW5 = DSHP03TS-S: BOM_Manufacturer: XKB Enterprise; Contributor: LCSC; BOM_Supplier: LCSC; BOM_Supplier Part: C319051; BOM_Manufacturer Part: DSHP03TS-S; BOM_JLCPCB Part Class: Extended Part; spicePre: S; spiceSymbolName: DSHP03TS-S
TP1 TP2 = TP-SWD-2.54-4P: Contributor: CYIIOT; Package Display: Yes; spicePre: T; spiceSymbolName: TP-SWD-2.54-4P
U1 = STM32F411CEU6: BOM_Manufacturer: STMicroelectronics; BOM_Supplier: LCSC; BOM_Manufacturer Part: STM32F411CEU6; BOM_Supplier Part: C60420; BOM_JLCPCB Part Class: Extended Part; spicePre: U; spiceSymbolName: STM32F411CEU6
U2 = 易微联蓝牙ECBO2S3: Contributor: WTDW; spicePre: U; spiceSymbolName: 易微联蓝牙ECBO2S3
U3 = TPS62082DSGR: BOM_Manufacturer: Texas Instruments; Contributor: LCSC; BOM_Supplier: LCSC; BOM_Supplier Part: C485809; BOM_Manufacturer Part: TPS62082DSGR; BOM_JLCPCB Part Class: Extended Part; spicePre: U; spiceSymbolName: TPS62082DSGR
U4 = BMP280: BOM_Manufacturer: Bosch; BOM_Supplier: LCSC; BOM_Manufacturer Part: BMP280; BOM_Supplier Part: C83291; BOM_JLCPCB Part Class: Extended Part; spicePre: U; spiceSymbolName: BMP280
U5 = VS1053B: BOM_Manufacturer: VLSI; sourceId: 1T5FDZYC8; timeStamp: 1459254824; BOM_Supplier: LCSC; BOM_Manufacturer Part: VS1053B; BOM_Supplier Part: C9922; BOM_JLCPCB Part Class: Extended Part; spicePre: U; spiceSymbolName: VS1053B
U6 = BL24C64A-NTRC: BOM_Manufacturer: BL(Shanghai Belling); Contributor: LCSC; BOM_Supplier: LCSC; BOM_Supplier Part: C691879; BOM_Manufacturer Part: BL24C64A-NTRC; BOM_JLCPCB Part Class: Extended Part; spicePre: U; spiceSymbolName: BL24C64A-NTRC
U7 = STM32F103CBU6: BOM_Manufacturer: ST; subpart_no: 1; tags: STM32; BOM_Supplier Part: C55506; BOM_Supplier: LCSC; BOM_Manufacturer Part: STM32F103CBU6; BOM_JLCPCB Part Class: Extended Part; spicePre: U; spiceSymbolName: STM32F103CBU6
U8 = CH9120: BOM_Manufacturer: WCH(南京沁恒); Contributor: LCSC; BOM_Supplier: LCSC; BOM_Supplier Part: C2681747; BOM_Manufacturer Part: CH9120; BOM_JLCPCB Part Class: Extended Part; spicePre: U; spiceSymbolName: CH9120
U9 = SHTC3: BOM_Manufacturer: Sensirion; Contributor: LCSC; BOM_Supplier: LCSC; BOM_Supplier Part: C194656; BOM_Manufacturer Part: SHTC3; BOM_JLCPCB Part Class: Extended Part; spicePre: U; spiceSymbolName: SHTC3
U10 = LCD0.96: Contributor: WTDW; spicePre: U; spiceSymbolName: LCD0.96
U11 = W25Q256JVEIQ: BOM_Manufacturer: WINBOND(华邦); Contributor: LCSC; BOM_Supplier: LCSC; BOM_Supplier Part: C2682312; BOM_Manufacturer Part: W25Q256JVEIQ; BOM_JLCPCB Part Class: Extended Part; spicePre: U; spiceSymbolName: W25Q256JVEIQ
U12 = 1117-1.8V: BOM_Manufacturer: TF; Contributor: LCSC; BOM_Supplier: LCSC; BOM_Supplier Part: C845412; BOM_Manufacturer Part: 1117-1.8V; BOM_JLCPCB Part Class: Extended Part; spicePre: U; spiceSymbolName: 1117-1.8V
USB1 = TYPE-C-31-M-10: BOM_Manufacturer: Korean Hroparts Elec; Contributor: LCSC; BOM_Supplier: LCSC; BOM_Supplier Part: C223904; BOM_Manufacturer Part: TYPE-C-31-M-10; BOM_JLCPCB Part Class: Extended Part; spicePre: U; spiceSymbolName: TYPE-C-31-M-10
USB2 = GT-USB-7010B: BOM_Manufacturer: G-Switch(品赞); Contributor: LCSC; BOM_Supplier: LCSC; BOM_Supplier Part: C2837092; BOM_Manufacturer Part: GT-USB-7010B; BOM_JLCPCB Part Class: Extended Part; spicePre: U; spiceSymbolName: GT-USB-7010B
X1 = 32.768kHz: BOM_Manufacturer: EPSON; BOM_Manufacturer Part: FC-12M32.768KHZ7PF20PPM; nameAlias: Frequency; BOM_Supplier: LCSC; BOM_Supplier Part: C99009; BOM_JLCPCB Part Class: Extended Part; spicePre: X; spiceSymbolName: FC-12M32.768KHZ7PF20PPM
X2 X4 = 8MHz: BOM_Manufacturer: TAITIEN Elec; BOM_Manufacturer Part: XXDCELNANF-8MHZ; nameAlias: Frequency; Contributor: LCSC; BOM_Paste Type: recommend; BOM_Supplier: LCSC; BOM_Supplier Part: C367183; spicePre: X; spiceSymbolName: XXDCELNANF-8MHZ
X3 = -: BOM_Manufacturer: NDK; BOM_Manufacturer Part: NX2016SA-32MHZ-STD-CZS-5; Contributor: LCSC; nameAlias: Frequency; BOM_Supplier: LCSC; BOM_Supplier Part: C843260; BOM_JLCPCB Part Class: Extended Part; spicePre: X; spiceSymbolName: NX2016SA-32MHZ-STD-CZS-5
X5 = SX3B12.288F1210F30: BOM_Manufacturer: SCTF(星通时频); Contributor: LCSC; BOM_Supplier: LCSC; BOM_Supplier Part: C2901654; BOM_Manufacturer Part: SX3B12.288F1210F30; spicePre: X; spiceSymbolName: SX3B12.288F1210F30